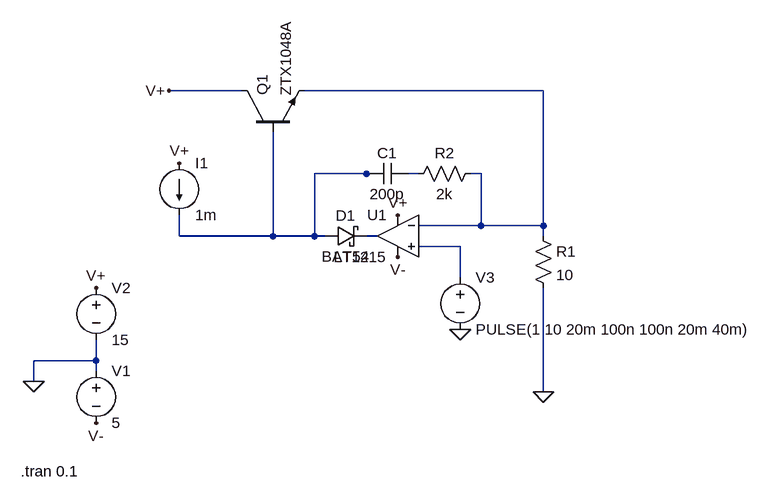
[diagram p0: schematic slew_rate_and_compensation.asc]
slew_rate_and_compensation.asc, the LTspice schematic file:
Version 4
SHEET 1 1248 680
WIRE 432 -272 320 -272
WIRE 896 -272 528 -272
WIRE 624 -144 544 -144
WIRE 640 -144 624 -144
WIRE 704 -144 688 -144
WIRE 800 -144 784 -144
WIRE 800 -64 800 -144
WIRE 800 -64 704 -64
WIRE 896 -64 896 -272
WIRE 896 -64 800 -64
WIRE 336 -48 336 -80
WIRE 480 -48 480 -208
WIRE 480 -48 336 -48
WIRE 544 -48 544 -144
WIRE 544 -48 480 -48
WIRE 560 -48 544 -48
WIRE 640 -48 624 -48
WIRE 896 -48 896 -64
WIRE 768 -32 704 -32
WIRE 768 16 768 -32
WIRE 208 144 208 112
WIRE 208 144 112 144
WIRE 208 160 208 144
WIRE 112 176 112 144
WIRE 896 192 896 32
FLAG 112 176 0
FLAG 208 240 V-
FLAG 208 32 V+
FLAG 320 -272 V+
FLAG 336 -160 V+
FLAG 672 -80 V+
FLAG 672 -16 V-
FLAG 896 192 0
FLAG 768 96 0
SYMBOL voltage 208 144 R0
WINDOW 123 0 0 Left 0
WINDOW 39 0 0 Left 0
SYMATTR InstName V1
SYMATTR Value 5
SYMBOL voltage 208 16 R0
WINDOW 123 0 0 Left 0
WINDOW 39 0 0 Left 0
SYMATTR InstName V2
SYMATTR Value 15
SYMBOL npn 432 -208 R270
SYMATTR InstName Q1
SYMATTR Value ZTX1048A
SYMBOL current 336 -160 R0
WINDOW 123 0 0 Left 0
WINDOW 39 0 0 Left 0
SYMATTR InstName I1
SYMATTR Value 1m
SYMBOL schottky 560 -32 R270
WINDOW 0 32 32 VTop 2
WINDOW 3 0 32 VBottom 2
SYMATTR InstName D1
SYMATTR Value BAT54
SYMATTR Description Diode
SYMATTR Type diode
SYMBOL res 880 -64 R0
SYMATTR InstName R1
SYMATTR Value 10
SYMBOL voltage 768 0 R0
WINDOW 123 0 0 Left 0
WINDOW 39 0 0 Left 0
SYMATTR InstName V3
SYMATTR Value PULSE(1 10 20m 100n 100n 20m 40m)
SYMBOL res 800 -160 R90
WINDOW 0 0 56 VBottom 2
WINDOW 3 32 56 VTop 2
SYMATTR InstName R2
SYMATTR Value 2k
SYMBOL cap 688 -160 R90
WINDOW 0 0 32 VBottom 2
WINDOW 3 32 32 VTop 2
SYMATTR InstName C1
SYMATTR Value 200p
SYMBOL Opamps\\LT1215 672 -112 M0
SYMATTR InstName U1
TEXT 92 314 Left 2 !.tran 0.1

The netlist it stands for:
* slew_rate_and_compensation.asc
V1 0 V- 5
V2 V+ 0 15
Q1 V+ N002 N001 0 ZTX1048A
I1 V+ N002 1m
D1 N002 N004 BAT54
R1 N001 0 10
V3 N005 0 PULSE(1 10 20m 100n 100n 20m 40m)
R2 N001 N003 2k
C1 N003 N002 200p
XU1 N005 N001 V+ V- N004 LT1215  ; pins In+ In- V+ V- OUT
.model D D
.lib standard.dio
.model NPN NPN
.model PNP PNP
.lib standard.bjt
.tran 0.1
.lib LTC.lib
.backanno
.end